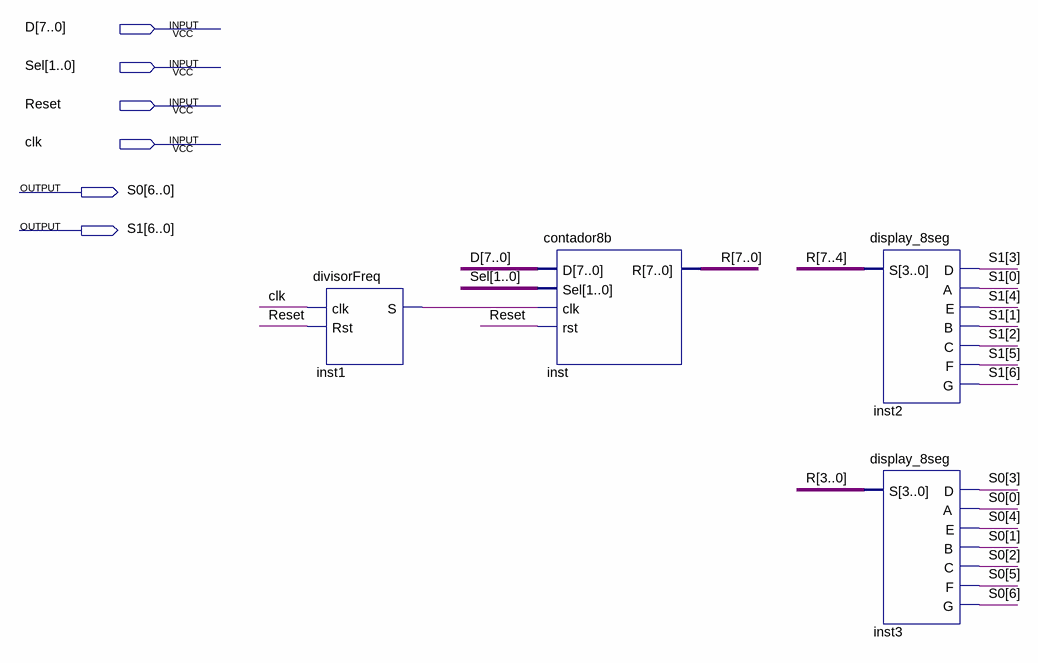
[diagram p0: schematic sheet]
// Quartus schematic lab08.bdf as structural Verilog: 4 symbols, 6 pins
module lab08 (
  input  [7:0] D,
  input  [1:0] Sel,
  input  Reset,
  input  clk,
  output [6:0] S0,
  output [6:0] S1
);

  wire inst1_s;
  wire [7:0] R;

  divisorFreq inst1 (.clk(clk), .Rst(Reset), .S(inst1_s));
  contador8b inst (.D(D), .Sel(Sel), .clk(inst1_s), .rst(Reset), .R(R));
  display_8seg inst2 (.S(R[7:4]), .D(S1[3]), .A(S1[0]), .E(S1[4]), .B(S1[1]), .C(S1[2]), .F(S1[5]), .G(S1[6]));
  display_8seg inst3 (.S(R[3:0]), .D(S0[3]), .A(S0[0]), .E(S0[4]), .B(S0[1]), .C(S0[2]), .F(S0[5]), .G(S0[6]));
endmodule
